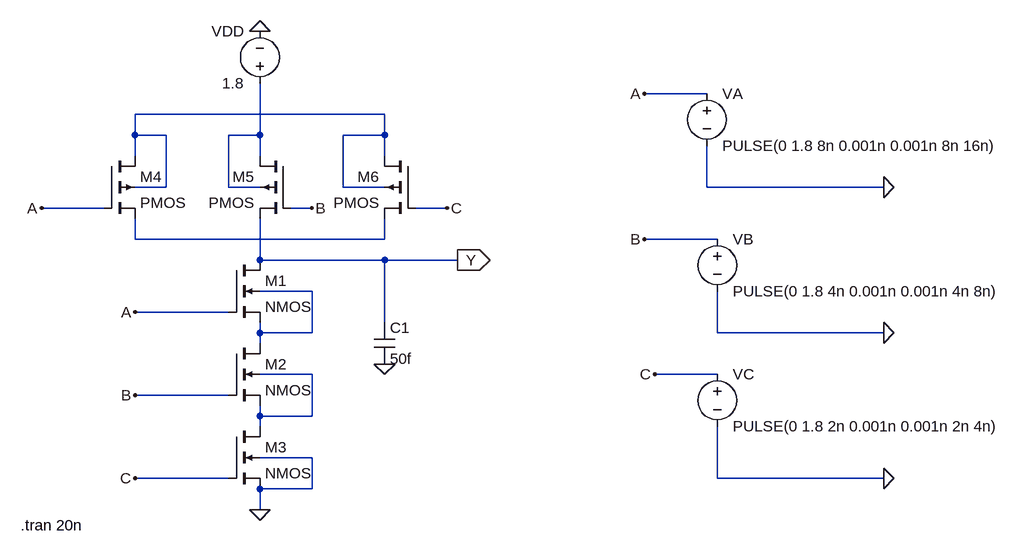
[diagram p0: schematic Draft4.asc]
Draft4.asc, the LTspice schematic file:
Version 4
SHEET 1 1264 680
WIRE 784 -128 688 -128
WIRE 288 -96 -96 -96
WIRE -96 -64 -96 -96
WIRE -48 -64 -96 -64
WIRE 96 -64 96 -144
WIRE 96 -64 48 -64
WIRE 288 -64 288 -96
WIRE 288 -64 224 -64
WIRE -96 -32 -96 -64
WIRE 96 -32 96 -64
WIRE 288 -32 288 -64
WIRE -48 16 -48 -64
WIRE -48 16 -96 16
WIRE 48 16 48 -64
WIRE 96 16 48 16
WIRE 224 16 224 -64
WIRE 288 16 224 16
WIRE 784 16 784 -48
WIRE 1056 16 784 16
WIRE -144 48 -240 48
WIRE 176 48 144 48
WIRE 384 48 336 48
WIRE -96 96 -96 64
WIRE 288 96 288 64
WIRE 288 96 -96 96
WIRE 800 96 688 96
WIRE 96 128 96 64
WIRE 288 128 96 128
WIRE 400 128 288 128
WIRE 176 176 96 176
WIRE 48 208 -96 208
WIRE 288 224 288 128
WIRE 96 240 96 224
WIRE 176 240 176 176
WIRE 176 240 96 240
WIRE 800 240 800 176
WIRE 1056 240 800 240
WIRE 96 256 96 240
WIRE 176 304 96 304
WIRE 800 304 704 304
WIRE 48 336 -96 336
WIRE 96 368 96 352
WIRE 176 368 176 304
WIRE 176 368 96 368
WIRE 96 384 96 368
WIRE 176 432 96 432
WIRE 48 464 -96 464
WIRE 800 464 800 384
WIRE 1056 464 800 464
WIRE 176 480 176 432
WIRE 176 480 96 480
WIRE 96 512 96 480
FLAG 96 512 0
FLAG 96 -224 0
FLAG 176 48 B
FLAG 384 48 C
FLAG -96 208 A
FLAG -240 48 A
FLAG -96 336 B
FLAG -96 464 C
FLAG 288 288 0
FLAG 400 128 Y
IOPIN 400 128 Out
FLAG 688 -128 A
FLAG 688 96 B
FLAG 704 304 C
FLAG 1056 16 0
FLAG 1056 240 0
FLAG 1056 464 0
SYMBOL nmos4 48 128 R0
SYMATTR InstName M1
SYMATTR Value2 l=0.18u w=0.36u
SYMBOL nmos4 48 256 R0
SYMATTR InstName M2
SYMATTR Value2 l=0.18u w=0.36u
SYMBOL nmos4 48 384 R0
SYMATTR InstName M3
SYMATTR Value2 l=0.18u w=0.36u
SYMBOL pmos4 -144 -32 R0
SYMATTR InstName M4
SYMATTR Value2 l=0.18u w=0.72u
SYMBOL pmos4 144 -32 M0
SYMATTR InstName M5
SYMATTR Value2 l=0.18u w=0.72u
SYMBOL pmos4 336 -32 M0
SYMATTR InstName M6
SYMATTR Value2 l=0.18u w=0.72u
SYMBOL voltage 96 -128 R180
WINDOW 0 24 96 Left 2
WINDOW 3 24 16 Left 2
SYMATTR InstName VDD
SYMATTR Value 1.8
SYMBOL cap 272 224 R0
SYMATTR InstName C1
SYMATTR Value 50f
SYMBOL voltage 784 -144 R0
WINDOW 123 0 0 Left 0
WINDOW 39 0 0 Left 0
SYMATTR InstName VA
SYMATTR Value PULSE(0 1.8 8n 0.001n 0.001n 8n 16n)
SYMBOL voltage 800 80 R0
WINDOW 123 0 0 Left 0
WINDOW 39 0 0 Left 0
SYMATTR InstName VB
SYMATTR Value PULSE(0 1.8 4n 0.001n 0.001n 4n 8n)
SYMBOL voltage 800 288 R0
WINDOW 123 0 0 Left 0
WINDOW 39 0 0 Left 0
SYMATTR InstName VC
SYMATTR Value PULSE(0 1.8 2n 0.001n 0.001n 2n 4n)
TEXT -272 536 Left 2 !.tran 20n

The netlist it stands for:
* Draft4.asc
M1 Y A N004 N004 NMOS l=0.18u w=0.36u
M2 N004 B N005 N005 NMOS l=0.18u w=0.36u
M3 N005 C 0 0 NMOS l=0.18u w=0.36u
M4 N001 A N003 N001 PMOS l=0.18u w=0.72u
M5 N002 B Y N002 PMOS l=0.18u w=0.72u
M6 N001 C N003 N001 PMOS l=0.18u w=0.72u
VDD N002 0 1.8
C1 Y 0 50f
VA A 0 PULSE(0 1.8 8n 0.001n 0.001n 8n 16n)
VB B 0 PULSE(0 1.8 4n 0.001n 0.001n 4n 8n)
VC C 0 PULSE(0 1.8 2n 0.001n 0.001n 2n 4n)
.model NMOS NMOS
.model PMOS PMOS
.lib standard.mos
.tran 20n
.backanno
.end